# Altium schematic sheet Schematic.SchDoc
size A4; SheetNumber: 1; SheetTotal: 1
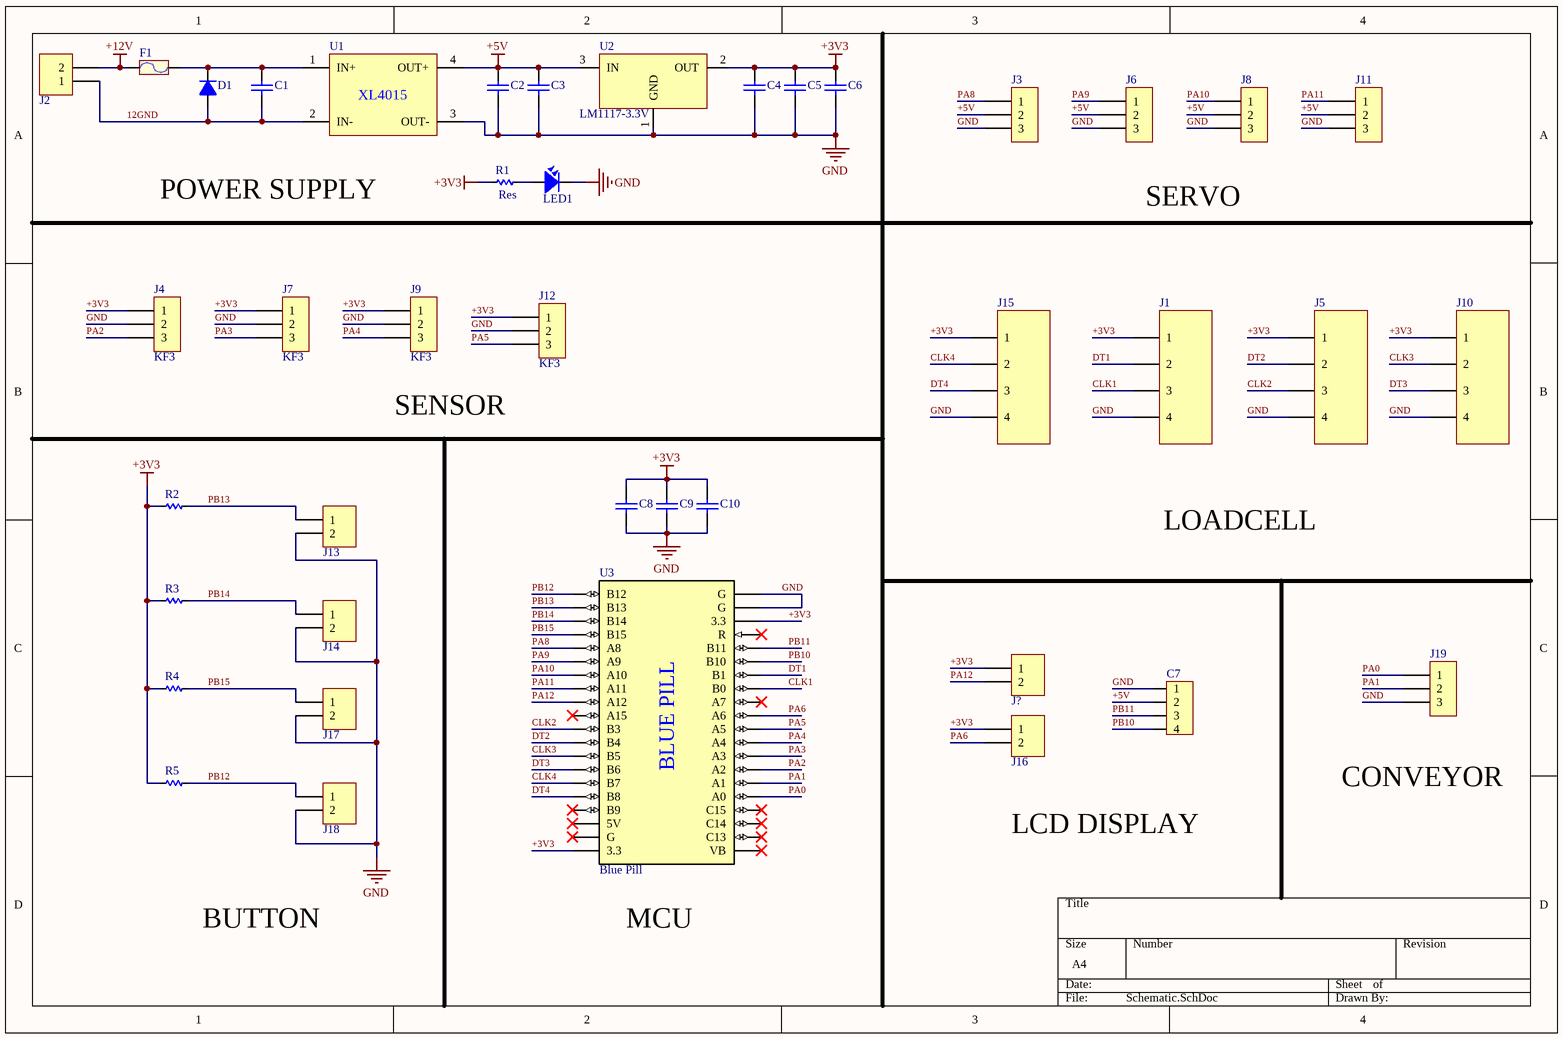
[diagram p0: Schematic.SchDoc]

## Parts
C1  104  [tu gom]  (value not drawn)
C2  104  [tu gom]  (value not drawn)
C3  106  [tu gom]  (value not drawn)
C4  104  [tu gom]  (value not drawn)
C5  106  [tu gom]  (value not drawn)
C6  104  [tu gom]  (value not drawn)
C7  Header4  [Header4]  (value not drawn)
C8  104  [tu gom]  (value not drawn)
C9  106  [tu gom]  (value not drawn)
C10  104  [tu gom]  (value not drawn)
D1  100v  [DIODE 1A]  (value not drawn)
F1  520  [De Cau Chi 520 630]  (value not drawn)
J1  KF4  [KF4-5.08]  (value not drawn)
J2  KF2  [KF2-5.08]  (value not drawn)
J3  KF3  [KF3-5.08]  (value not drawn)
J4  KF3  [KF3-5.08]
J5  KF4  [KF4-5.08]  (value not drawn)
J6  KF3  [KF3-5.08]  (value not drawn)
J7  KF3  [KF3-5.08]
J8  KF3  [KF3-5.08]  (value not drawn)
J9  KF3  [KF3-5.08]
J10  KF4  [KF4-5.08]  (value not drawn)
J11  KF3  [KF3-5.08]  (value not drawn)
J12  KF3  [KF3-5.08]
J13  KF2  [KF2-5.08]  (value not drawn)
J14  KF2  [KF2-5.08]  (value not drawn)
J15  KF4  [KF4-5.08]  (value not drawn)
J16  KF2  [KF2-5.08]  (value not drawn)
J17  KF2  [KF2-5.08]  (value not drawn)
J18  KF2  [KF2-5.08]  (value not drawn)
J19  KF3  [KF3-5.08]  (value not drawn)
J?  KF2  [KF2-5.08]  (value not drawn)
LED1  LED  [LED-3MM-YELLOW]  (value not drawn)
R1  Res  [RES-1/2W]
R2  Res  [RES-1/2W]  (value not drawn)
R3  Res  [RES-1/2W]  (value not drawn)
R4  Res  [RES-1/2W]  (value not drawn)
R5  Res  [RES-1/2W]  (value not drawn)
U1  XL4015  [XL4015 MODULE]  (value not drawn)
U2  LM1117-3.3V  [TO220-123]
U3  Blue Pill  [Blue Pill STM32F103]

## Nets
+3V3: C4.1 C5.1 C6.1 C8.1 C9.1 C10.1 J1.1 J4.1 J5.1 J7.1 J9.1 J10.1 J12.1 J15.1 J16.1 J?.1 R1.2 R2.2 R3.2 R4.2 R5.2 U2.2(OUT) U3.20(3.3) U3.38(3.3)
+5V: C2.1 C3.1 C7.2 J3.2 J6.2 J8.2 J11.2 U1.4(OUT+) U2.3(IN)
+12V: F1.1 J2.2
GND: C2.2 C3.2 C4.2 C5.2 C6.2 C7.1 C8.2 C9.2 C10.2 J1.4 J3.3 J4.2 J5.4 J6.3 J7.2 J8.3 J9.2 J10.4 J11.3 J12.2 J13.2 J14.2 J15.4 J17.2 J18.2 J19.3 LED1.2 U1.3(OUT-) U2.1(GND) U3.39(G) U3.40(G)
12GND: C1.2 D1.1(A) J2.1 U1.2(IN-)
CLK1: J1.3 U3.33(B0)
CLK2: J5.3 U3.11(B3)
CLK3: J10.2 U3.13(B5)
CLK4: J15.2 U3.15(B7)
DT1: J1.2 U3.34(B1)
DT2: J5.2 U3.12(B4)
DT3: J10.3 U3.14(B6)
DT4: J15.3 U3.16(B8)
PA0: J19.1 U3.25(A0)
PA1: J19.2 U3.26(A1)
PA2: J4.3 U3.27(A2)
PA3: J7.3 U3.28(A3)
PA4: J9.3 U3.29(A4)
PA5: J12.3 U3.30(A5)
PA6: J16.2 U3.31(A6)
PA8: J3.1 U3.5(A8)
PA9: J6.1 U3.6(A9)
PA10: J8.1 U3.7(A10)
PA11: J11.1 U3.8(A11)
PA12: J?.2 U3.9(A12)
PB10: C7.4 U3.35(B10)
PB11: C7.3 U3.36(B11)
PB12: J18.1 R5.1 U3.1(B12)
PB13: J13.1 R2.1 U3.2(B13)
PB14: J14.1 R3.1 U3.3(B14)
PB15: J17.1 R4.1 U3.4(B15)
NetC1_1: C1.1 D1.2(K) F1.2 U1.1(IN+)
NetLED1_1: LED1.1 R1.1

Not connected (* = marked no-connect by the designer): U3 10(A15)* 17(B9)* 18(5V)* 19(G)* 21(VB)* 22(C13)* 23(C14)* 24(C15)* 32(A7)* 37(R)*

## Notes on the sheet
- POWER SUPPLY
- SERVO
- SENSOR
- LOADCELL
- CONVEYOR
- LCD DISPLAY
- BUTTON
- (near U3) MCU
- (in symbol Blue Pill STM32F103) BLUE PILL

## Library data of the parts
C1-C6 C8-C10 = Tu gom 104 50V: Cắm; So_Chan: 2; Ten_Linh_Kien: Tụ gốm 104 100nF 50V; Don_Vi: Con; Ma_Hang: MH004761; Chung_Loai: Cắm; Kieu_Chan: *
C7 = Header4: Header IDC, 4 x 1 Pin Vertical 2.54mm Pitch (Non-Boxed, Male); Manufacturer: W¨¹rth Elektronik eiSos GmbH; partNo: 613002143121; ComponentLink1 Description: Manufacturer; ComponentLink2 Description: Datasheet; NoPins: 02; Created Date: 29 March 2013; ComponentLink1URL: http://www.we-online.com; ComponentLink2URL: http://katalog.we-online.de/em/datasheet/6130xx143121.pdf; Created by: Karrer Zheng
D1 = Diode 1N4007: Cắm; Ten_Linh_Kien: Diode 1N4007 1A (DIP); Don_Vi: Con; Ma_Hang: MH001063; Ghi Chu: *; Kieu_Chan: *; Chung_Loai: Cắm
F1 = De Cau Chi 520 630: 5x20mm; Ma_Hang: MH001473; Ten: Đế Cầu Chì 5x20MM 6x30MM SMD01
J1 J5 J10 J15 = KF4: Manufacturer: W¨¹rth Elektronik eiSos GmbH; PartNo: 691133710004; ComponentLink1 Description: Manufacturer; ComponentLink2 Description: Datasheet; NoPins: 4; ComponentLink1 URL: http://www.we-online.com; ComponentLink2 URL: http://katalog.we-online.de/em/datasheet/6911337100xx.pdf; Created By: Baojun Chen; Created Date: 4-Aug-15
J2 J13 J14 J16-J18 J? = KF2: Manufacturer: Würth Elektronik eiSos GmbH; partNo: 691103110002; ComponentLink1 Description: Manufacturer; ComponentLink2 Description: Datasheet; NoPins: 2; Created Date: 29 October 2013; ComponentLink1URL: http://www.we-online.com; ComponentLink2URL: http://katalog.we-online.de/em/datasheet/6911031100xx.pdf; Created by: Karrer Zheng
J3 J4 J6-J9 J11 J12 J19 = KF3: Manufacturer: Würth Elektronik eiSos GmbH; partNo: 691103110003; ComponentLink1 Description: Manufacturer; ComponentLink2 Description: Datasheet; NoPins: 3; Created Date: 29 October 2013; ComponentLink1URL: http://www.we-online.com; ComponentLink2URL: http://katalog.we-online.de/em/datasheet/6911031100xx.pdf; Created by: Karrer Zheng
LED1 = LED: LED Single colour Green and Red; Value: LED 3 ly Single Colour
R1-R5 = Res: Manufacturer: Generic Components; Class: Passive; SubClass: R; Published: 08/06/2000; Publisher: Altium Hobart Technology Centre
U1 = XL4015 Module: DC - DC Buck 5A
U2 = LM1117: 800mA Low-Dropout Linear Regulator; Creator: Nguyen Ba Bien; Website: http://group3i.net
U3 = Blue Pill STM32F103: Blue Pill STM32F103C8T6